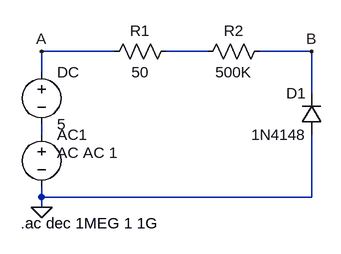
[diagram p0: schematic 3 quiza.asc]
3 quiza.asc, the LTspice schematic file:
Version 4
SHEET 1 880 680
WIRE 32 112 -80 112
WIRE 176 112 112 112
WIRE 336 112 256 112
WIRE -80 144 -80 112
WIRE 336 176 336 112
WIRE -80 240 -80 224
WIRE -80 336 -80 320
WIRE 336 336 336 240
WIRE 336 336 -80 336
WIRE -80 352 -80 336
FLAG -80 352 0
FLAG -80 112 A
FLAG 336 112 B
DATAFLAG 336 112 ""
DATAFLAG 336 112 ""
SYMBOL res 128 96 R90
WINDOW 0 0 56 VBottom 2
WINDOW 3 32 56 VTop 2
SYMATTR InstName R1
SYMATTR Value 50
SYMBOL res 272 96 R90
WINDOW 0 0 56 VBottom 2
WINDOW 3 32 56 VTop 2
SYMATTR InstName R2
SYMATTR Value 500K
SYMBOL diode 352 240 R180
WINDOW 0 24 64 Left 2
WINDOW 3 24 0 Left 2
SYMATTR InstName D1
SYMATTR Value 1N4148
SYMBOL voltage -80 224 R0
WINDOW 123 24 44 Left 2
WINDOW 39 0 0 Left 0
SYMATTR Value2 AC AC 1
SYMATTR InstName AC1
SYMATTR Value ""
SYMBOL voltage -80 128 R0
WINDOW 123 0 0 Left 0
WINDOW 39 0 0 Left 0
SYMATTR InstName DC
SYMATTR Value 5
TEXT -112 376 Left 2 !.ac dec 1MEG 1 1G

The netlist it stands for:
* 3 quiza.asc
R1 N001 A 50
R2 B N001 500K
D1 0 B 1N4148
V§AC1 N002 0 AC AC 1
V§DC A N002 5
.model D D
.lib standard.dio
.ac dec 1MEG 1 1G
.backanno
.end